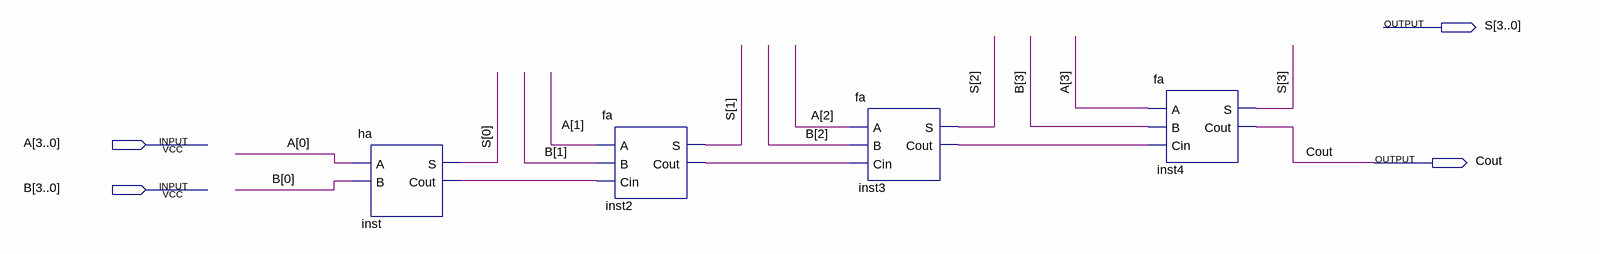
[diagram p0: schematic sheet]
// Quartus schematic somador_rca_4b.bdf as structural Verilog: 4 symbols, 4 pins
module somador_rca_4b (
  input  [3:0] A,
  input  [3:0] B,
  output [3:0] S,
  output Cout
);

  wire inst2_cout, inst3_cout, inst_cout;

  ha inst (.A(A[0]), .B(B[0]), .S(S[0]), .Cout(inst_cout));
  fa inst2 (.A(A[1]), .B(B[1]), .Cin(inst_cout), .S(S[1]), .Cout(inst2_cout));
  fa inst3 (.A(A[2]), .B(B[2]), .Cin(inst2_cout), .S(S[2]), .Cout(inst3_cout));
  fa inst4 (.A(A[3]), .B(B[3]), .Cin(inst3_cout), .S(S[3]), .Cout(Cout));
endmodule
